# Altium schematic sheet IR.SchDoc
size A4
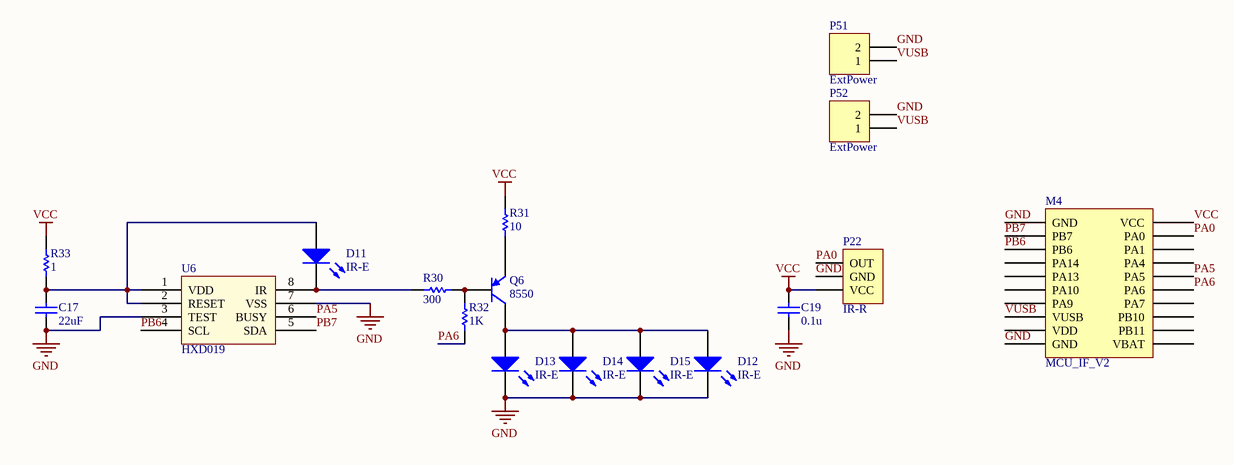
[diagram p0: IR.SchDoc]

## Parts
C17  value 22uF  [C-2012[0805]]  (hidden comment: Cap Semi)
C19  value 0.1u  [C-1608[0603]]  (hidden comment: Cap Semi)
D11  IR-E  [PIN2]
D12  IR-E  [PIN2]
D13  IR-E  [PIN2]
D14  IR-E  [PIN2]
D15  IR-E  [PIN2]
M4  MCU_IF_V2  [MCU_IF_V2]
P22  IR-R  [HDR1X3]
P51  ExtPower  [HDR1X2H]
P52  ExtPower  [HDR1X2H]
Q6  8550  [SOT-23B]
R30  value 300  [R-1608[0603]]  (hidden comment: Res Semi)
R31  value 10  [R-2012[0805]]  (hidden comment: Res Semi)
R32  value 1K  [R-1608[0603]]  (hidden comment: Res Semi)
R33  value 1  [R-2012[0805]]  (hidden comment: Res Semi)
U6  HXD019  [SOP8]

## Nets
GND: C17.2 C19.1 D12.2(K) D13.2(K) D14.2(K) D15.2(K) M4.1(GND) M4.10(GND) P22.2(GND) P51.2 P52.2 U6.3(TEST) U6.7(VSS)
VCC: C19.2 M4.20(VCC) P22.3(VCC) R31.1 R33.1
PA0: M4.19(PA0) P22.1(OUT)
PA5: M4.16(PA5) U6.6(BUSY)
PA6: M4.15(PA6) R32.1
PB6: M4.3(PB6) U6.4(SCL)
PB7: M4.2(PB7) U6.5(SDA)
VUSB: M4.8(VUSB) P51.1 P52.1
NetC17_1: C17.1 D11.1(A) R33.2 U6.1(VDD) U6.2(RESET)
NetD11_2: D11.2(K) R30.1 U6.8(IR)
NetD12_1: D12.1(A) D13.1(A) D14.1(A) D15.1(A) Q6.1(C)
NetQ6_2: Q6.2(B) R30.2 R32.2
NetQ6_3: Q6.3(E) R31.2

Not connected (* = marked no-connect by the designer): M4 4(PA14) 5(PA13) 6(PA10) 7(PA9) 9(VDD) 11(VBAT) 12(PB11) 13(PB10) 14(PA7) 17(PA4) 18(PA1)

## Library data of the parts
C17 C19 = Cap Semi: Capacitor (Semiconductor SIM Model); Published: 8-Jun-2000; PackageReference: C1206; Publisher: Altium Limited
  C17: LatestRevisionDate: 29-May-2009; LatestRevisionNote: IPC-7351 Footprint Added.; PackageDescription: Chip Capacitor
  C19: LatestRevisionDate: 17-Jul-2002; LatestRevisionNote: Re-released for DXP Platform.
D11-D15 = LED0: Typical INFRARED GaAs LED; Published: 8-Jun-2000; LatestRevisionDate: 08-Jul-2005; LatestRevisionNote: Mech Layer 1 removed.; PackageReference: LED-0; Publisher: Altium Limited
M4 = MCU_IF_V1
P22 = IR: Header, 3-Pin; LatestRevisionDate: 17-Jul-2002; LatestRevisionNote: Re-released for DXP Platform.; Publisher: Altium Limited
P51 P52 = Header 2H: Header, 2-Pin, Right Angle; LatestRevisionDate: 17-Jul-2002; LatestRevisionNote: Re-released for DXP Platform.; Publisher: Altium Limited
Q6 = PNP: PNP Bipolar Transistor; pin to pad: 1>3 2>1 3>2; Published: 8-Jun-2000; LatestRevisionDate: 17-Jul-2002; LatestRevisionNote: Re-released for DXP Platform.; PackageReference: SOT-23B; Publisher: Altium Limited; Code_JEDEC: SOT-23
R30-R33 = Res Semi: Semiconductor Resistor; Published: 8-Jun-2000; LatestRevisionDate: 17-Jul-2002; LatestRevisionNote: Re-released for DXP Platform.; PackageReference: AXIAL-0.5; Publisher: Altium Limited